# EAGLE design LCmeter0-perfboard-new (EAGLE 7.3.0)
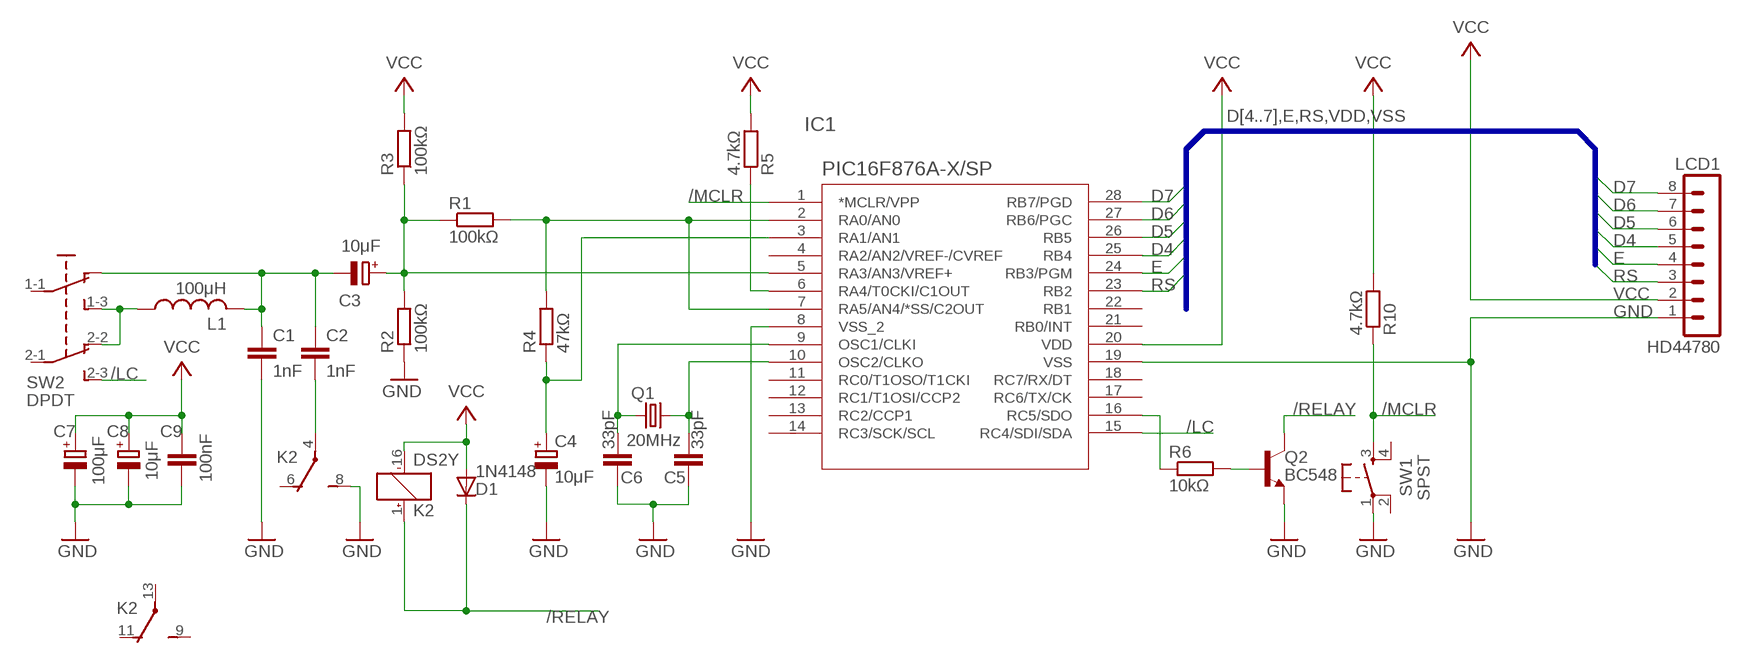
[diagram p0: schematic, sheet 1]

## Parts
C1  1nF  C-EU050-024X044  [C050-024X044]
C2  1nF  C-EU050-024X044  [C050-024X044]
C3  10μF  CPOL-EUE5-4  [E5-4]
C4  10μF  CPOL-EUE5-4  [E5-4]
C5  33pF  C-EU050-024X044  [C050-024X044]
C6  33pF  C-EU050-024X044  [C050-024X044]
C7  100μF  CPOL-EUE2.5-6  [E2,5-6]
C8  10μF  CPOL-EUE2.5-5  [E2,5-5]
C9  100nF  C-EU025-024X044  [C025-024X044]
D1  1N4148  1N4148DO35-7  [DO35-7]
IC1  PIC16F876A-X/SP  [DIL28-3]
K2  DS2Y  DS2Y-S-DC5V  [DS2Y]
L1  100μH  L-US0204/5  [0204/5]
LCD1  HD44780  MA08-1  [MA08-1]
Q1  20MHz  CRYSTALHC49S  [HC49/S]
Q2  BC548  [TO92-EBC]
R1  100kΩ  R-EU_0204/7  [0204/7]
R2  100kΩ  R-EU_0204/2V  [0204V]
R3  100kΩ  R-EU_0204/2V  [0204V]
R4  47kΩ  R-EU_0204/2V  [0204V]
R5  4.7kΩ  R-EU_0207/10  [0207/10]
R6  10kΩ  R-EU_0204/2V  [0204V]
R10  4.7kΩ  R-EU_0207/10  [0207/10]
SW1  SPST  PB-SPST  [PB-5]
SW2  DPDT  S-DPDT  [DPDT]

## Nets
/LC: IC1.15(RC4/SDI/SDA) SW2.2-3
/MCLR: IC1.1(*MCLR/VPP) R10.1 SW1.3(S)
/RELAY: D1.C K2.1(1:+) Q2.C
A0: IC1.2(RA0/AN0) IC1.7(RA5/AN4/*SS/C2OUT) R1.2 R4.2
A1: C4.+ IC1.3(RA1/AN1) R4.1
A3: C3.+ IC1.5(RA3/AN3/VREF+) R1.1 R2.2 R3.1
A4: IC1.6(RA4/T0CKI/C1OUT) R5.1
C2_CON: C2.2 K2.4(2:P)
D4: IC1.25(RB4) LCD1.5
D5: IC1.26(RB5) LCD1.6
D6: IC1.27(RB6/PGC) LCD1.7
D7: IC1.28(RB7/PGD) LCD1.8
E: IC1.24(RB3/PGM) LCD1.4
GND: C1.2 C4.- C5.1 C6.1 C7.- C8.- C9.2 IC1.8(VSS_2) IC1.19(VSS) K2.8(2:S) LCD1.1 Q2.E R2.1 SW1.1(P)
N$2: C1.1 C2.1 C3.- L1.2 SW2.1-2
N$5: Q2.B R6.2
N$7: L1.1 SW2.1-3 SW2.2-2
OSC1: C6.2 IC1.9(OSC1/CLKI) Q1.1
OSC2: C5.2 IC1.10(OSC2/CLKO) Q1.2
RC5: IC1.16(RC5/SDO) R6.1
RS: IC1.23(RB2) LCD1.3
VCC: C7.+ C8.+ C9.1 D1.A IC1.20(VDD) K2.16(1:-) LCD1.2 R3.2 R5.2 R10.2
Unconnected: IC1.4(RA2/AN2/VREF-/CVREF) IC1.11(RC0/T1OSO/T1CKI) IC1.12(RC1/T1OSI/CCP2) IC1.13(RC2/CCP1) IC1.14(RC3/SCK/SCL) IC1.17(RC6/TX/CK) IC1.18(RC7/RX/DT) IC1.21(RB0/INT) IC1.22(RB1) K2.6(2:O) K2.9(3:S) K2.11(3:O) K2.13(3:P) SW1.2(P1) SW1.4(S1) SW2.1-1 SW2.2-1

## Buses
D[4..7],E,RS,VDD,VSS

## Library data of the parts
C1 C2 C5 C6 C9 = rcl:C-EU: CAPACITOR, European symbol
C3 C4 C7 C8 = rcl:CPOL-EU: POLARIZED CAPACITOR, European symbol
D1 = diode:1N4148: DIODE high speed (Philips)
IC1 = mcu:PIC16F876A-X/SP
K2 = relay:DS2Y-S-DC*: MINIATURE RELAY NAiS Source: http://www.mew-europe.com/.. en_ds_61005_0023.pdf; MPN: DS2Y-S-DC5V; OC_FARNELL: unknown; OC_NEWARK: 13P3268
L1 = rcl:L-US: INDUCTOR, American symbol
LCD1 = con-lstb:MA08-1: PIN HEADER; OC_FARNELL: unknown; OC_NEWARK: unknown
Q1 = crystal:CRYSTAL: CRYSTAL; OC_FARNELL: 1667008; OC_NEWARK: unknown
Q2 = transistor-npn:BC548*: NPN Transistor
R1 = rcl:R-EU_: RESISTOR, European symbol
R2-R6 R10 = resistor:R-EU_: RESISTOR, European symbol
SW1 = mcu:PB-SPST
SW2 = mcu:S-DPDT

## Board
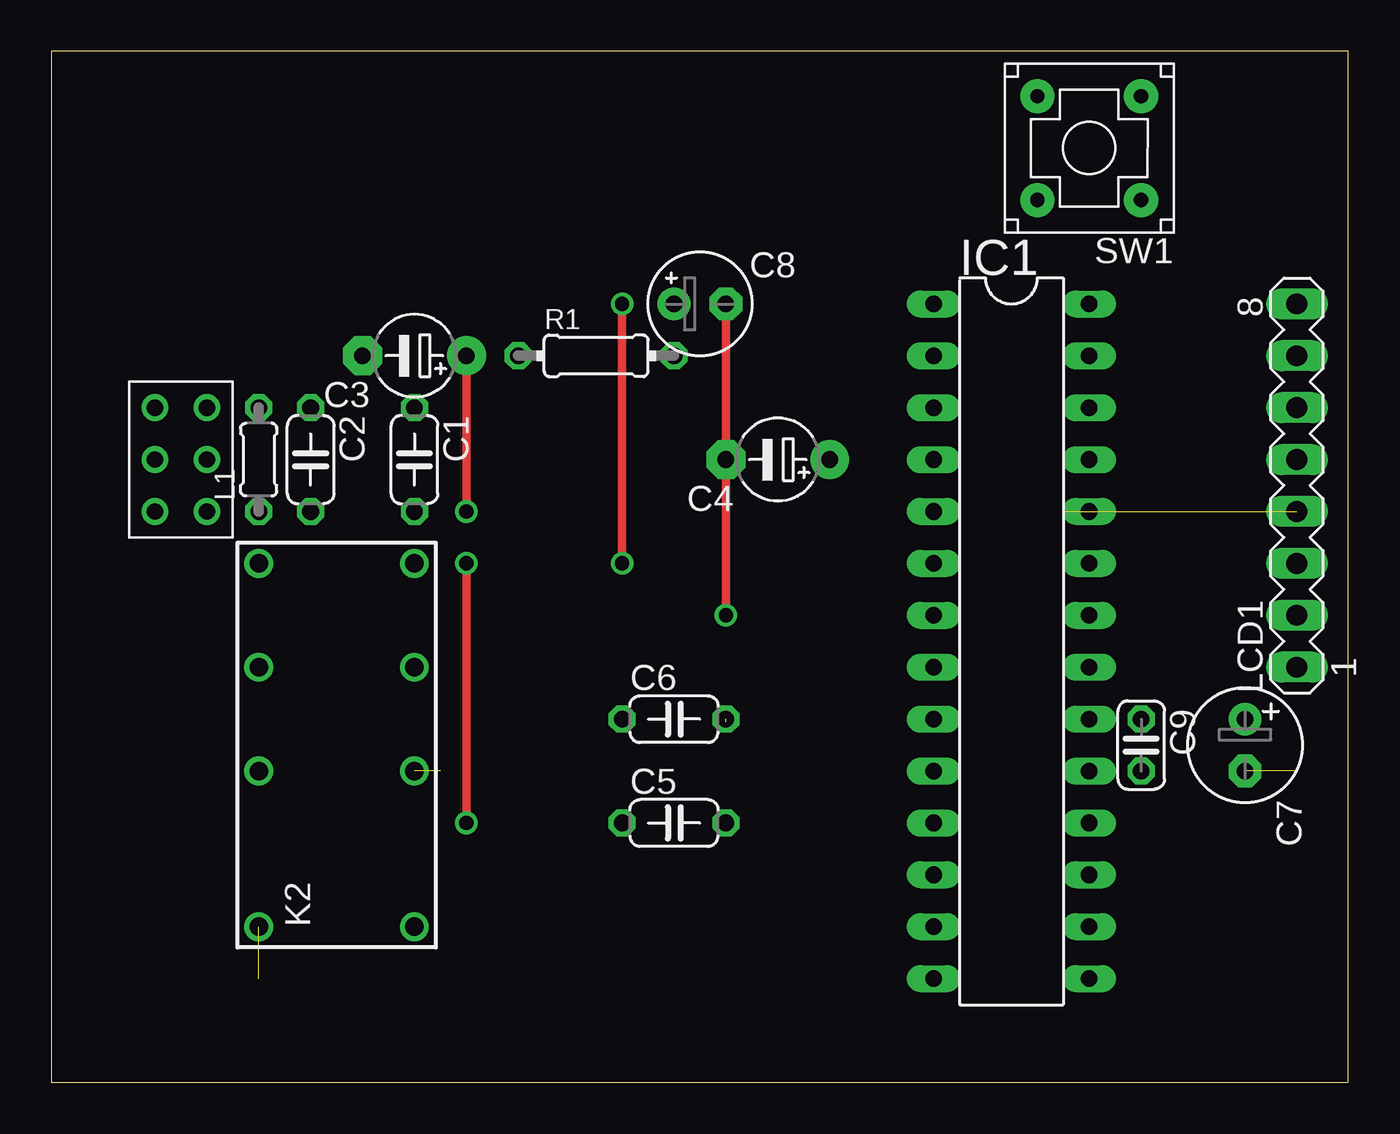
[diagram p1: board, top side]
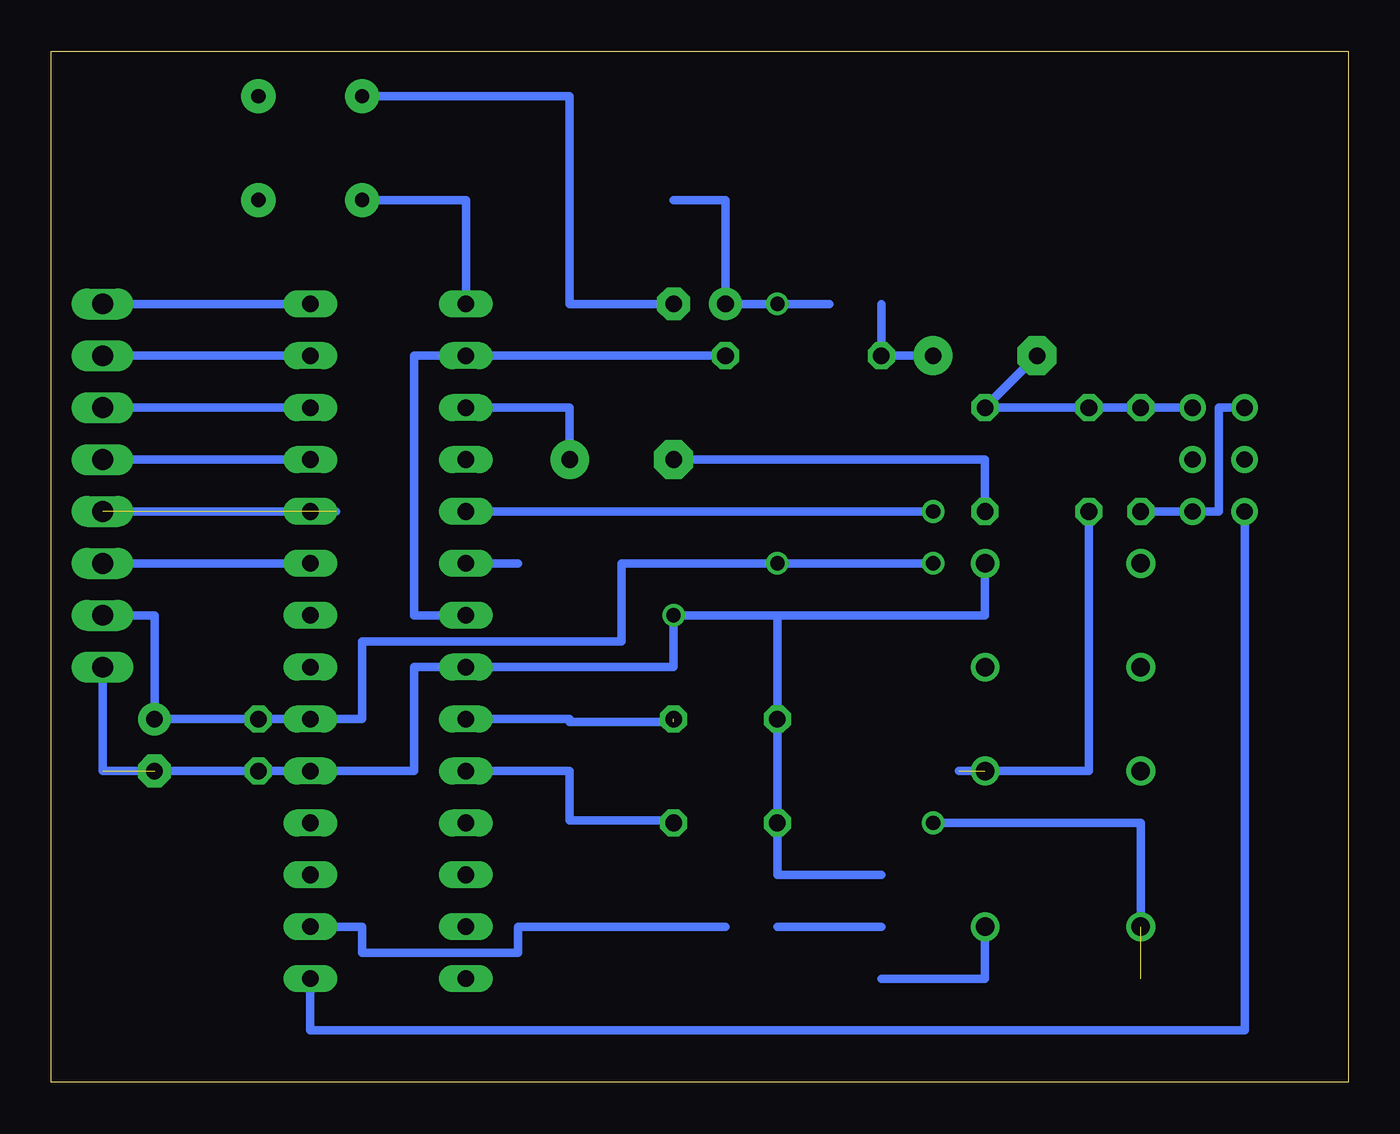
[diagram p2: board, bottom side, seen from below]

Size 63.48 x 50.47 mm. Coordinates in mm from the lower left corner, seen from the top.
Outline: 0,0 63.48,0 63.48,50.47 0,50.47 0,0
Copper layers (1*16): Top 0.035mm / dielectric 1.5mm / Bottom 0.035mm
Design rules "default": minimum track width 10mil, minimum drill 24mil, track to track 8mil, track to pad 8mil, pad to pad 8mil, via to via 8mil, smd to smd 8mil, copper to edge 40mil, drill to drill 8mil, minimum pad ring 10mil, minimum via ring 8mil, stop-mask expansion 4mil, vias tented up to drill 0mil, thermal gap 10mil

### Footprints (pad centres in the part's own frame; a part is rotated, then mirrored left to right if it is on the bottom)
C050-024X044 = drill 0.813 octagon: 1 -2.54,0; 2 2.54,0
E5-4 = drill 0.813 pad 1.905: + -2.54,0 | drill 0.813 pad 1.905 octagon: - 2.54,0
E2,5-6 = drill 0.813 pad 1.6: + -1.27,0 | drill 0.813 pad 1.6 octagon: - 1.27,0
E2,5-5 = drill 0.813 pad 1.6: + -1.27,0 | drill 0.813 pad 1.6 octagon: - 1.27,0
C025-024X044 = drill 0.813 octagon: 1 -1.27,0; 2 1.27,0
DIL28-3 = drill 0.813 long: 1 -16.51,-3.81; 2 -13.97,-3.81; 3 -11.43,-3.81; 4 -8.89,-3.81; 5 -6.35,-3.81; 6 -3.81,-3.81; 7 -1.27,-3.81; 8 1.27,-3.81; 9 3.81,-3.81; 10 6.35,-3.81; 11 8.89,-3.81; 12 11.43,-3.81; 13 13.97,-3.81; 14 16.51,-3.81; 15 16.51,3.81; 16 13.97,3.81; 17 11.43,3.81; 18 8.89,3.81; 19 6.35,3.81; 20 3.81,3.81; 21 1.27,3.81; 22 -1.27,3.81; 23 -3.81,3.81; 24 -6.35,3.81; 25 -8.89,3.81; 26 -11.43,3.81; 27 -13.97,3.81; 28 -16.51,3.81
DS2Y = drill 0.9: 1 -8.89,-3.81; 4 -1.27,-3.81; 6 3.81,-3.81; 8 8.89,-3.81; 9 8.89,3.81; 11 3.81,3.81; 13 -1.27,3.81; 16 -8.89,3.81
0204/5 = drill 0.813 octagon: 1 -2.54,0; 2 2.54,0
MA08-1 = drill 1.016 long: 1 -8.89,0; 2 -6.35,0; 3 -3.81,0; 4 -1.27,0; 5 1.27,0; 6 3.81,0; 7 6.35,0; 8 8.89,0
0204/7 = drill 0.813 octagon: 1 -3.81,0; 2 3.81,0
PB-5 = drill 0.7 pad 1.676: 1 2.54,-2.54; 2 -2.54,-2.54; 3 2.54,2.54; 4 -2.54,2.54
DPDT = drill 0.8: 1-1 0,1.27; 1-2 -2.54,1.27; 1-3 2.54,1.27; 2-1 0,-1.27; 2-2 -2.54,-1.27; 2-3 2.54,-1.27

### Placement (x,y rotation side)
C1  17.78,30.48 270 top
C2  12.7,30.48 270 top
C3  17.78,35.56 180 top
C4  35.56,30.48 180 top
C5  30.48,12.7 0 top
C6  30.48,17.78 0 top
C7  58.42,16.51 270 top
C8  31.75,38.1 0 top
C9  53.34,16.51 270 top
D1  13.97,5.08 180 top
IC1  46.99,21.59 270 top
K2  13.97,16.51 90 top
L1  10.16,30.48 90 top
LCD1  60.96,29.21 90 top
Q1  38.1,15.24 270 top
Q2  21.59,7.62 90 top
R1  26.67,35.56 0 top
R2  22.86,29.21 270 top
R3  24.13,38.1 0 top
R4  38.1,34.29 90 top
R5  35.56,25.4 180 top
R6  29.21,7.62 180 top
R10  38.1,43.18 180 top
SW1  50.8,45.72 180 top
SW2  6.35,30.48 270 top

### Tracks (layer width: path | path; a pad name or v marks a point on that pad's centre or on a via)
/LC
  Bottom 0.406: SW2.2-3 5.08,2.54 50.8,2.54 IC1.15
/MCLR
  Bottom 0.406: SW1.3 43.18,43.18 IC1.1
/RELAY
  Bottom 0.406: 22.86,5.08 17.78,5.08 K2.1
A0
  Bottom 0.406: IC1.7 45.72,22.86 45.72,35.56 IC1.2 38.1,35.56 R1.2
A1
  Bottom 0.406: IC1.3 38.1,33.02 C4.+
A3  (via drill 0.7)
  Top 0.406: C3.+ v20.32,27.94
  Bottom 0.406: IC1.5 22.86,27.94 v20.32,27.94 | 22.86,38.1 R1.1 C3.+
A4
  Bottom 0.406: 40.64,25.4 IC1.6
C2_CON  (1 unrouted)
  Bottom 0.406: C2.2 12.7,15.24 19.05,15.24
D4
  Bottom 0.406: IC1.25 LCD1.5
D5
  Bottom 0.406: LCD1.6 IC1.26
D6
  Bottom 0.406: IC1.27 LCD1.7
D7
  Bottom 0.406: IC1.28 LCD1.8
E  (1 unrouted)
  Bottom 0.406: 62.23,27.94 IC1.24 49.53,27.94
GND  (via drill 0.7)  (1 unrouted)
  Top 0.406: C8.- C4.- v33.02,22.86
  Bottom 0.406: C8.- 38.1,38.1 38.1,48.26 SW1.1 | C4.- 22.86,30.48 17.78,30.48 C1.2 | K2.8 17.78,22.86 27.94,22.86 | 27.94,22.86 C6.1 C5.1 27.94,10.16 22.86,10.16 | 27.94,22.86 v33.02,22.86 33.02,20.32 IC1.8 45.72,20.32 45.72,15.24 IC1.19 C9.2 60.96,15.24 LCD1.1
N$2
  Bottom 0.406: C3.- C1.1 C2.1 L1.2 SW2.1-2
N$5
  Bottom 0.406: 27.94,7.62 22.86,7.62
N$7
  Bottom 0.406: L1.1 SW2.1-3 6.35,27.94 6.35,33.02 SW2.2-2
OSC1  (1 unrouted)
  Bottom 0.406: 33.02,17.65 38.1,17.65 38.1,17.78 IC1.9
OSC2
  Bottom 0.406: C5.2 33.02,12.83 38.1,12.83 38.1,15.24 IC1.10
RC5
  Bottom 0.406: IC1.16 48.26,7.62 48.26,6.35 40.64,6.35 40.64,7.62 30.48,7.62
RS
  Bottom 0.406: IC1.23 LCD1.3
VCC  (via drill 0.7)  (1 unrouted)
  Top 0.406: v27.94,25.4 v27.94,38.1 | v20.32,25.4 v20.32,12.7
  Bottom 0.406: 33.02,43.18 30.48,43.18 C8.+ v27.94,38.1 25.4,38.1 | v20.32,25.4 v27.94,25.4 30.48,25.4 35.56,25.4 35.56,21.59 48.26,21.59 48.26,17.78 IC1.20 C9.1 C7.+ 58.42,22.86 LCD1.2 | v20.32,12.7 10.16,12.7 K2.16